# EAGLE schematic Z21 MEGA_2 (EAGLE 6.6.0)
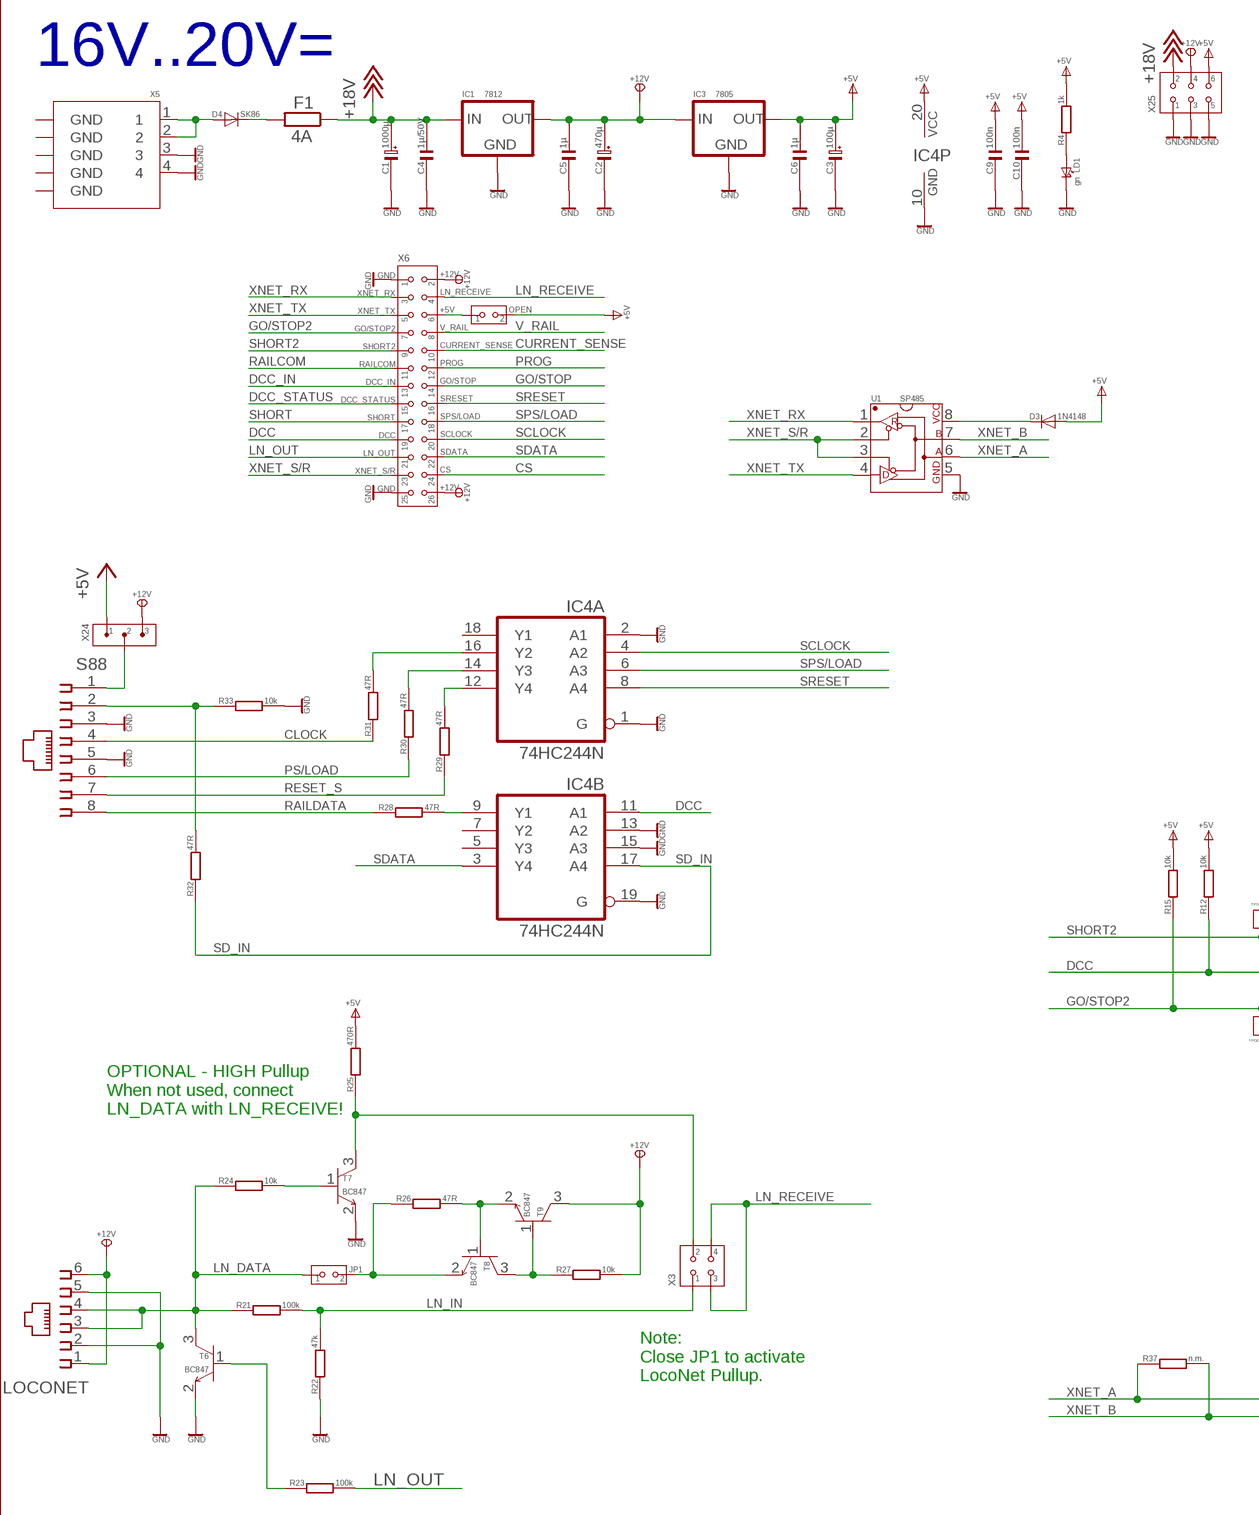
[diagram p0: schematic, sheet 1, part 1 of 2]
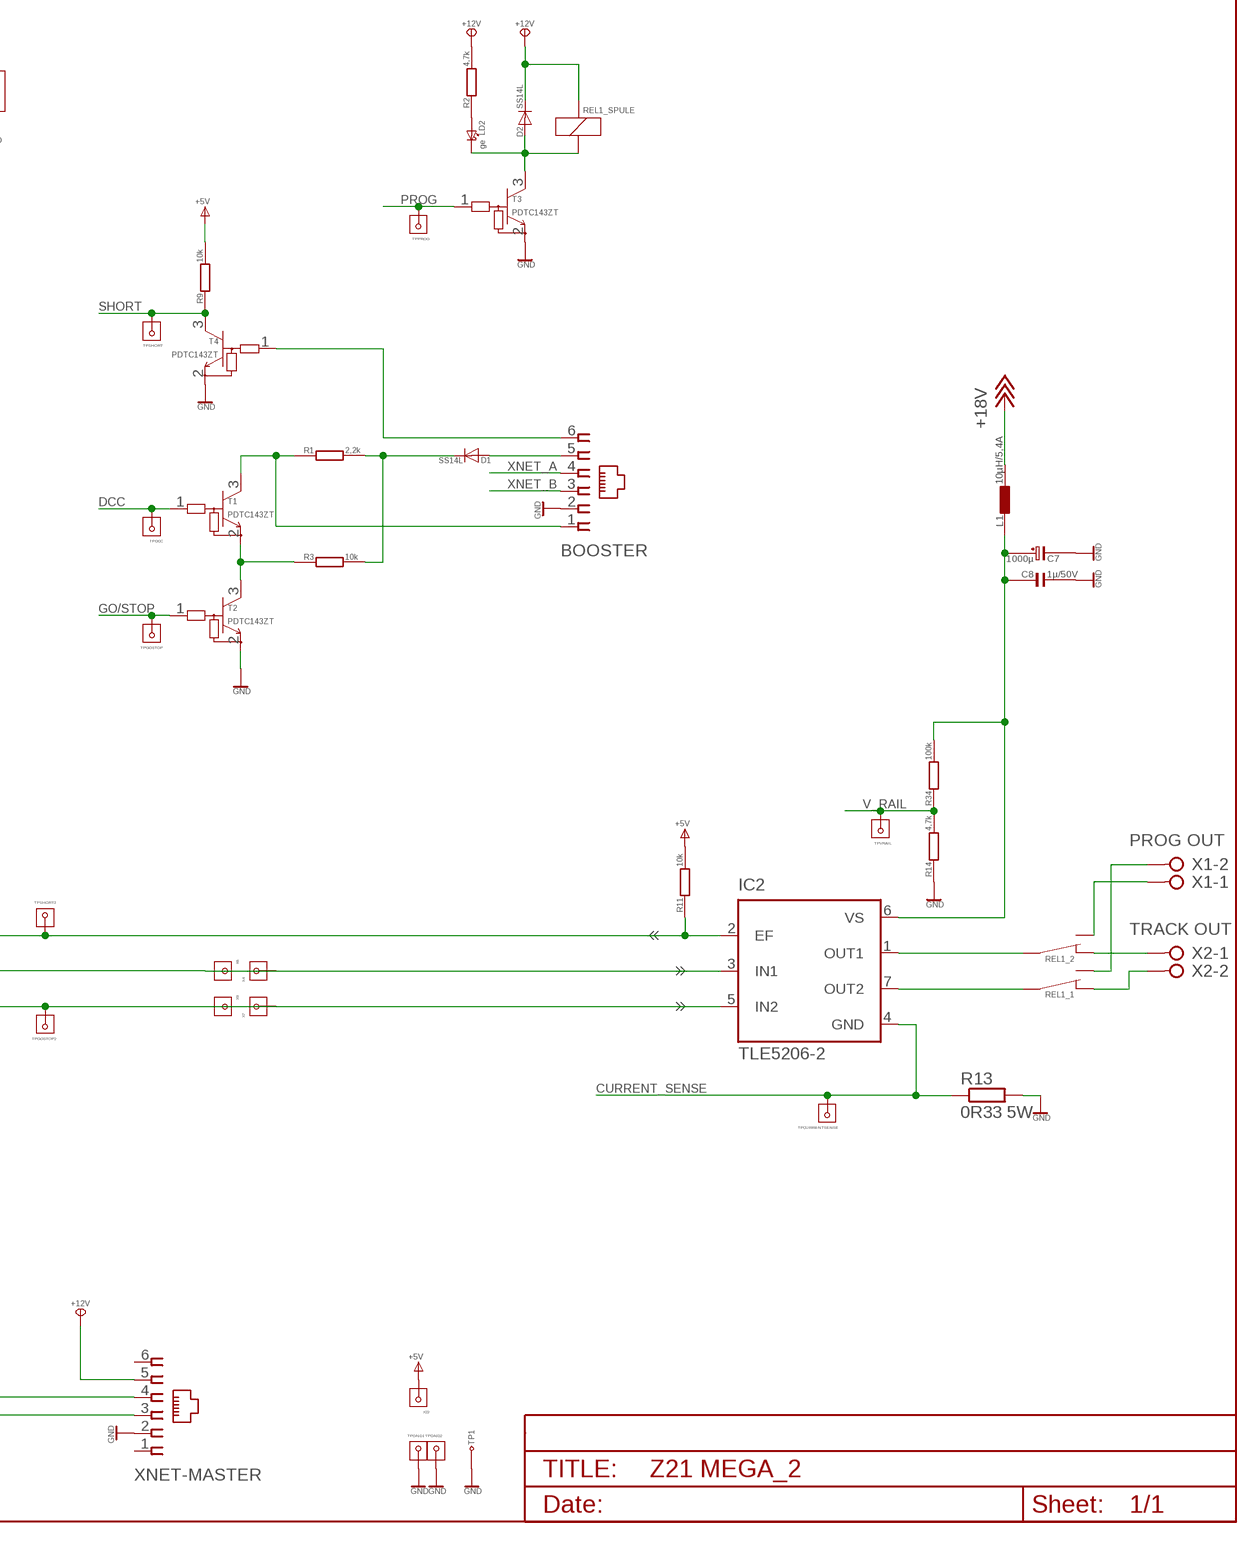
[diagram p1: schematic, sheet 1, part 2 of 2]

## Parts
BOOSTER  520250-3  [520250-3]
C1  1000µ  ELKORM5_DIA12.5  [RM5_DIA12.5]
C2  470µ  ELKORM5_DIA10  [RM5_DIA10]
C3  100µ  ELKORM2.5_DIA6  [RM2.5_DIA6]
C4  1µ/50V  C0805  [C0805]
C5  1µ  C0805  [C0805]
C6  1µ  C0805  [C0805]
C7  1000µ  ELKORM5_DIA12.5  [RM5_DIA12.5]
C8  1µ/50V  C0805  [C0805]
C9  100n  C0805  [C0805]
C10  100n  C0805  [C0805]
D1  SS14L  DIODESUB-SMA_  [SUB-SMA_]
D2  SS14L  DIODESUB-SMA_  [SUB-SMA_]
D3  1N4148  DIODESOD323  [SOD323_]
D4  SK86  DIODESMC_  [SMC_]
F1  4A  R-EU_0204/5  [0204/5]
IC1  7812  78XXLSTEHEND  [78XXS]
IC2  TLE5206-2  TLE5205-2  [P-TO220-7-11]
IC3  7805  78XXLSTEHEND  [78XXS]
IC4  74HC244N  [DIL20]
JP1  1X02_JUMPER_2.54MM  [1X02_2.54MM]
L1  10µH/5,4A  L12,5X12,5MM  [12,5X12,5MM]
LD1  gn  LED3MM_  [LED3MM_]
LD2  ge  LED3MM_  [LED3MM_]
LOCONET  520250-3  [520250-3]
OPEN  1X02_JUMPER_2.54MM  [1X02_2.54MM]
R1  2,2k  R0805  [R0805]
R2  4,7k  R0805  [R0805]
R3  10k  R0805  [R0805]
R4  1k  R0805  [R0805]
R9  10k  R0805  [R0805]
R11  10k  R0805  [R0805]
R12  10k  R0805  [R0805]
R13  0R33 5W  R-EU_VMTA55  [VMTA55]
R14  4,7k  R0805  [R0805]
R15  10k  R0805  [R0805]
R21  100k  R0805  [R0805]
R22  47k  R0805  [R0805]
R23  100k  R0805  [R0805]
R24  10k  R0805  [R0805]
R25  470R  R0805  [R0805]
R26  47R  R0805  [R0805]
R27  10k  R0805  [R0805]
R28  47R  R0805  [R0805]
R29  47R  R0805  [R0805]
R30  47R  R0805  [R0805]
R31  47R  R0805  [R0805]
R32  47R  R0805  [R0805]
R33  10k  R0805  [R0805]
R34  100k  R0805  [R0805]
R37  n.m.  R0805  [R0805]
REL1  DIL16_1FINDER_40.527  [FINDER_40.527]
S88  520251-4  [520251-4]
T1  PDTC143ZT  NPN_PRE-BIASED  [SOT23_]
T2  PDTC143ZT  NPN_PRE-BIASED  [SOT23_]
T3  PDTC143ZT  NPN_PRE-BIASED  [SOT23_]
T4  PDTC143ZT  NPN_PRE-BIASED  [SOT23_]
T6  BC847  NPNSOT23  [SOT23_]
T7  BC847  NPNSOT23  [SOT23_]
T8  BC847  NPNSOT23  [SOT23_]
T9  BC847  NPNSOT23  [SOT23_]
TP1  LÖTPUNKTTHT_1.3MM_51.2MIL  [THT_1.3MM_51.2MIL]
TPCURRENTSENSE  1X01_2.54MM  [1X01_2.54MM]
TPDCC  1X01_2.54MM  [1X01_2.54MM]
TPGND1  1X01_2.54MM  [1X01_2.54MM]
TPGND2  1X01_2.54MM  [1X01_2.54MM]
TPGOSTOP  1X01_2.54MM  [1X01_2.54MM]
TPGOSTOP2  1X01_2.54MM  [1X01_2.54MM]
TPPROG  1X01_2.54MM  [1X01_2.54MM]
TPSHORT  1X01_2.54MM  [1X01_2.54MM]
TPSHORT2  1X01_2.54MM  [1X01_2.54MM]
TPVRAIL  1X01_2.54MM  [1X01_2.54MM]
U1  SP485  MAX3485  [SO8__]
X1  PROG OUT  W237-02P  [W237-132]
X2  TRACK OUT  W237-02P  [W237-132]
X3  2X02_2.54MM  [2X02_2.54MM]
X4  1X01_2.54MM  [1X01_2.54MM]
X5  MDINBU4-POWER  [MDINBU4-POWER]
X6  2X13_WANNE_180°  [2X13_WANNE_180°]
X7  1X01_2.54MM  [1X01_2.54MM]
X8  1X01_2.54MM  [1X01_2.54MM]
X9  1X01_2.54MM  [1X01_2.54MM]
X22  1X01_2.54MM  [1X01_2.54MM]
X24  1X03T2,54MM  [1X03_2.54MM]
X25  2X03_2.54MM  [2X03_2.54MM]
XNET-MASTER  520250-3  [520250-3]

## Nets
+5V: C3.PLUS C6.2 C9.2 C10.2 D3.ANODE IC3.OUT IC4.20(P:VCC) OPEN.P$2 R4.P$2 R9.P$2 R11.P$2 R12.P$2 R15.P$2 R25.P$2 X22.P$1 X24.P$1 X25.P$6
+12V: C2.PLUS C5.2 D2.K(KATHODE) IC1.OUT IC3.IN LOCONET.1 LOCONET.6 R2.P$2 R27.P$2 REL1.SP1(_SPULE:+) T9.3(C) X6.P$2 X6.P$26 X24.P$3 X25.P$4 XNET-MASTER.5
+18V: C1.PLUS C4.2 F1.1 IC1.IN L1.P$2 X25.P$2
CLOCK: R31.P$1 S88.4
CS: X6.P$24
CURRENT_SENSE: IC2.4(GND) R13.1 TPCURRENTSENSE.P$1 X6.P$10
DCC: IC2.3(IN1) IC4.11(B:A1) R12.P$1 T1.1(B) TPDCC.P$1 X4.P$1 X6.P$19 X8.P$1
DCC_IN: X6.P$13
DCC_STATUS: X6.P$15
GND: BOOSTER.2 C1.MINUS C2.MINUS C3.MINUS C4.1 C5.1 C6.1 C7.MINUS C8.2 C9.1 C10.1 IC1.GND IC3.GND IC4.1(A:G) IC4.2(A:A1) IC4.10(P:GND) IC4.13(B:A2) IC4.15(B:A3) IC4.19(B:G) LD1.K(KATHODE) LOCONET.2 LOCONET.5 R13.2 R14.P$1 R22.P$1 R33.P$2 S88.3 S88.5 T2.2(E) T3.2(E) T4.2(E) T6.2(E) T7.2(E) TP1.P$1 TPGND1.P$1 TPGND2.P$1 U1.5 X5.3 X5.4 X6.P$1 X6.P$25 X25.P$1 X25.P$3 X25.P$5 XNET-MASTER.2
GO/STOP: T2.1(B) TPGOSTOP.P$1 X6.P$14
GO/STOP2: IC2.5(IN2) R15.P$1 TPGOSTOP2.P$1 X6.P$7 X7.P$1 X9.P$1
LN_DATA: JP1.P$1 LOCONET.3 LOCONET.4 R21.P$1 R24.P$1 T6.3(C)
LN_IN: R21.P$2 R22.P$2 X3.P$1
LN_OUT: R23.P$2 X6.P$21
LN_RECEIVE: X3.P$3 X3.P$4 X6.P$4
N$1: OPEN.P$1 X6.P$6
N$2: D1.K(KATHODE) R1.P$2 R3.P$2
N$3: IC2.7(OUT2) REL1.P1(_1:P)
N$4: IC2.1(OUT1) REL1.P2(_2:P)
N$5: R3.P$1 T1.2(E) T2.3(C)
N$6: REL1.Ö2(_2:Ö) X2.1
N$7: D4.K(KATHODE) F1.2
N$8: D4.A(ANODE) X5.1 X5.2
N$9: C7.PLUS C8.1 IC2.6(VS) L1.P$1 R34.P$2
N$12: D3.KATHODE U1.8
N$13: D2.A(ANODE) LD2.K(KATHODE) REL1.SP2(_SPULE:-) T3.3(C)
N$15: REL1.Ö1(_1:Ö) X2.2
N$17: REL1.S2(_2:S) X1.1
N$18: REL1.S1(_1:S) X1.2
N$26: R26.P$2 T8.1(B) T9.2(E)
N$27: R23.P$1 T6.1(B)
N$28: R24.P$2 T7.1(B)
N$29: R27.P$1 T8.3(C) T9.1(B)
N$30: IC4.9(B:Y1) R28.P$2
N$31: IC4.14(A:Y3) R30.P$2
N$32: IC4.16(A:Y2) R31.P$2
N$33: IC4.12(A:Y4) R29.P$2
N$35: R32.P$2 R33.P$1 S88.2
N$36: JP1.P$2 R26.P$1 T8.2(E)
N$40: S88.1 X24.P$2
N$47: BOOSTER.6 T4.1(B)
N$48: BOOSTER.1 R1.P$1 T1.3(C)
N$52: LD2.A(ANODE) R2.P$1
N$159: LD1.A(ANODE) R4.P$1
N$227: R25.P$1 T7.3(C) X3.P$2
N$238: BOOSTER.5 D1.A(ANODE)
PROG: T3.1(B) TPPROG.P$1 X6.P$12
PS/LOAD: R30.P$1 S88.6
RAILCOM: X6.P$11
RAILDATA: R28.P$1 S88.8
RESET_S: R29.P$1 S88.7
SCLOCK: IC4.4(A:A2) X6.P$20
SD_IN: IC4.17(B:A4) R32.P$1
SDATA: IC4.3(B:Y4) X6.P$22
SHORT: R9.P$1 T4.3(C) TPSHORT.P$1 X6.P$17
SHORT2: IC2.2(EF) R11.P$1 TPSHORT2.P$1 X6.P$9
SPS/LOAD: IC4.6(A:A3) X6.P$18
SRESET: IC4.8(A:A4) X6.P$16
V_RAIL: R14.P$2 R34.P$1 TPVRAIL.P$1 X6.P$8
XNET_A: BOOSTER.4 R37.P$1 U1.6 XNET-MASTER.4
XNET_B: BOOSTER.3 R37.P$2 U1.7 XNET-MASTER.3
XNET_RX: U1.1 X6.P$3
XNET_S/R: U1.2 U1.3 X6.P$23
XNET_TX: U1.4 X6.P$5
Unconnected: IC4.5(B:Y3) IC4.7(B:Y2) IC4.18(A:Y1) X5.GND@1(GND) X5.GND@2(GND) X5.GND@3(GND) X5.GND@4(GND) X5.GND@5(GND) XNET-MASTER.1 XNET-MASTER.6

## Notes on the sheet
- 16V..20V=
- OPTIONAL - HIGH Pullup
  When not used, connect 
  LN_DATA with LN_RECEIVE!
- Note:
  Close JP1 to activate
  LocoNet Pullup.

## Library data of the parts
BOOSTER LOCONET XNET-MASTER = con-amp:520250-3: AMP connector
C1-C3 C7 = C-Elko:ELKO
C4-C6 C8-C10 = C:C
D1-D4 = Dioden:DIODE
F1 R13 = rcl:R-EU_: RESISTOR, European symbol
IC1 IC3 = Spannungsregler:78XXL: VOLTAGE REGULATOR
IC2 = infineon:TLE5205-2: 5-A H-Bridge for DC-Motor Applications Source: http://www.infineon.com .. tle5205-2.pdf; OC_FARNELL: unknown; OC_NEWARK: unknown
IC4 = 74xx-eu:74*244: Octal BUFFER and LINE DRIVER, 3-state
JP1 OPEN = Stiftleisten:1X02_JUMPER
L1 = L:L
LD1 LD2 = LEDs:LED
R1-R4 R9 R11 R12 R14 R15 R21-R34 R37 = R:R
REL1 = Relais:DIL16_1: DIL Relais Siemens V23042-A1001-X022 5V (3,75..9V) 95Ohm Schaltspannung: 250V Schaltstrom: 2A Schaltleistung: 50..150W
S88 = con-amp:520251-4: AMP connector
T1-T4 = Transistoren:NPN_PRE-BIASED: z.B. PDTC143ZT: 4,7k:47k
T6-T9 = Transistoren:NPN
TP1 = Lötpunkte:LÖTPUNKT
TPCURRENTSENSE TPDCC TPGND1 TPGND2 TPGOSTOP TPGOSTOP2 TPPROG TPSHORT TPSHORT2 TPVRAIL X4 X7-X9 X22 = Stiftleisten:1X01
U1 = RS485:MAX3485
X1 X2 = con-wago-508:W237-02P: WAGO SREW CLAMP; OC_FARNELL: unknown; OC_NEWARK: unknown
X3 = Stiftleisten:2X02
X5 = Mini-DIN-Power:MDINBU4-POWER
X6 = Z21-Connector:2X13
X24 = Stiftleisten:1X03T
X25 = Stiftleisten:2X03